# EAGLE design campainha (EAGLE 7.4.0)
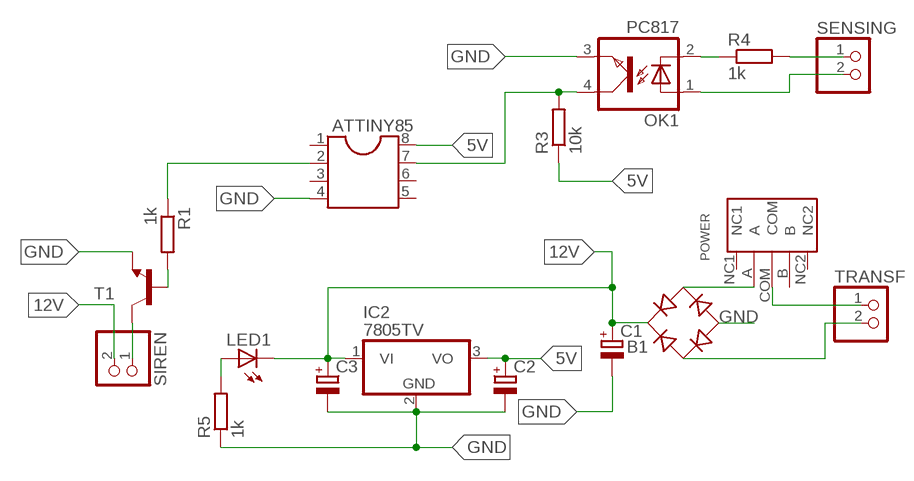
[diagram p0: schematic, sheet 1]

## Parts
ATTINY85  DIL8S  [SOCKET-08]
B1  DBDB104G  [DB]
C1  CPOL-EUE2,5-6E  [E2,5-6E]
C2  CPOL-EUE1.8-4  [E1,8-4]
C3  CPOL-EUE1.8-4  [E1,8-4]
IC2  7805TV  [TO220V]
LED1  LED3MM  [LED3MM]
OK1  PC817  [DIL04]
POWER  SWITCH-2H-3P-REINFORCE  [3P-2CH-2.0-8.8X4.4X4.7H-90D-REINFORCE]
R1  1k  R-EU_0204/7  [0204/7]
R3  10k  R-EU_0204/7  [0204/7]
R4  1k  R-EU_0204/7  [0204/7]
R5  1k  R-EU_0204/7  [0204/7]
SENSING  PINHD-1X2  [1X02]
SIREN  PINHD-1X2  [1X02]
T1  TRANSISTOR_NPNTO92  [TO-92]
TRANSF  PINHD-1X2  [1X02]

## Nets
5V: ATTINY85.8 C2.+ IC2.3(VO) R3.1
12V: B1.+ C1.+ C3.+ IC2.1(VI) LED1.K(C) SIREN.2
GND: ATTINY85.4 B1.- C1.- C2.- C3.- IC2.2(GND) OK1.3(EMIT) R5.1 T1.1(E)
N$1: OK1.2(C) R4.1
N$2: R4.2 SENSING.1
N$3: OK1.1(A) SENSING.2
N$4: ATTINY85.7 OK1.4(COL) R3.2
N$5: B1.AC2 POWER.A
N$6: POWER.COM TRANSF.1
N$7: B1.AC1 TRANSF.2
N$8: ATTINY85.2 R1.1
N$9: R1.2 T1.2(B)
N$11: SIREN.1 T1.3(C)
N$13: LED1.A R5.2
Unconnected: ATTINY85.1 ATTINY85.3 ATTINY85.5 ATTINY85.6 POWER.B POWER.NC1 POWER.NC2

## Library data of the parts
ATTINY85 = pedro:DIL8: Dual In Line / Socket
B1 = rectifier:DB?*G: Single Phase 1.0 AMP Glass Passivated Bridge Rectifier Taiwan Semiconductor Co.,Ltd. - TSC Source: http://www.taiwansemi.com/TSCbig5/ezcatfiles/cust/img/img/db101g.pdf http://www.ts.com.tw/db/pictures/modules/PDT/PDT060207001/DBLS201G.pdf
C1-C3 = rcl:CPOL-EU: POLARIZED CAPACITOR, European symbol
IC2 = linear:78*: Positive VOLTAGE REGULATOR Source: http://cache.national.com/ds/LM/LM78L05.pdf http://www.fairchildsemi.com/ds/LM/LM7805.pdf
LED1 = led:LED: LED OSRAM: - CHIPLED LG R971, LG N971, LY N971, LG Q971, LY Q971, LO R971, LY R971 LH N974, LH R974 LS Q976, LO Q976, LY Q976 LO Q996 - Hyper CHIPLED LW Q18S LB Q993, LB Q99A, LB R99A - SideLED LS A670, LO A670, LY A670, LG A670, LP A670 LB A673, LV A673, LT A673, LW A673 LH A674 LY A675 LS A676, LA A676, LO A676, LY A676, LW A676 LS A679, LY A679, LG A679 - Hyper Micro SIDELED® LS Y876, LA Y876, LO Y876, LY Y876 LT Y87S - SmartLED LW L88C, LW L88S LB L89C, LB L89S, LG L890 LS L89K, LO L89K, LY L89K LS L896, LA L896, LO L896, LY L896 - TOPLED LS T670, LO T670, LY T670, LG T670, LP T670 LSG T670, LSP T670, LSY T670, LOP T670, LYG T670 LG T671, LOG T671, LSG T671 LB T673, LV T673, LT T673, LW T673 LH T674 LS T676, LA T676, LO T676, LY T676, LB T676, LH T676, LSB T676, LW T676 LB T67C, LV T67C, LT T67C, LS T67K, LO T67K, LY T67K, LW E67C LS E67B, LA E67B, LO E67B, LY E67B, LB E67C, LV E67C, LT E67C LW T67C LS T679, LY T679, LG T679 LS T770, LO T770, LY T770, LG T770, LP T770 LB T773, LV T773, LT T773, LW T773 LH T774 LS E675, LA E675, LY E675, LS T675 LS T776, LA T776, LO T776, LY T776, LB T776 LHGB T686 LT T68C, LB T68C - Hyper Mini TOPLED® LB M676 - Mini TOPLED Santana® LG M470 LS M47K, LO M47K, LY M47K Source: http://www.osram.convergy.de LUXEON: - LUMILED® LXK2-PW12-R00, LXK2-PW12-S00, LXK2-PW14-U00, LXK2-PW14-V00 LXK2-PM12-R00, LXK2-PM12-S00, LXK2-PM14-U00 LXK2-PE12-Q00, LXK2-PE12-R00, LXK2-PE12-S00, LXK2-PE14-T00, LXK2-PE14-U00 LXK2-PB12-K00, LXK2-PB12-L00, LXK2-PB12-M00, LXK2-PB14-N00, LXK2-PB14-P00, LXK2-PB14-Q00 LXK2-PR12-L00, LXK2-PR12-M00, LXK2-PR14-Q00, LXK2-PR14-R00 LXK2-PD12-Q00, LXK2-PD12-R00, LXK2-PD12-S00 LXK2-PH12-R00, LXK2-PH12-S00 LXK2-PL12-P00, LXK2-PL12-Q00, LXK2-PL12-R00 Source: www.luxeon.com KINGBRIGHT: KA-3528ASYC Source: www.kingbright.com
OK1 = optocoupler:PC817: SHARP OPTO COUPLER; MPN: PC817X4J000F; OC_FARNELL: 9707727; OC_NEWARK: 97K7059
POWER = pedro:SWITCH-2H-3P-REINFORCE
R1 R3-R5 = resistor:R-EU_: RESISTOR, European symbol
SENSING SIREN TRANSF = pinhead:PINHD-1X2: PIN HEADER
T1 = SparkFun-DiscreteSemi:TRANSISTOR_NPN: Generic NPN BJT MMBT2222A - TRANS-08049 (SOT-23, 1A 40V) MPSA42 - TRANS-09116 (SOT-23, 500mA 300V) MMBT5088LT1G - TRANS-11160 (SOT-23, 50 mA 30V)

## Board
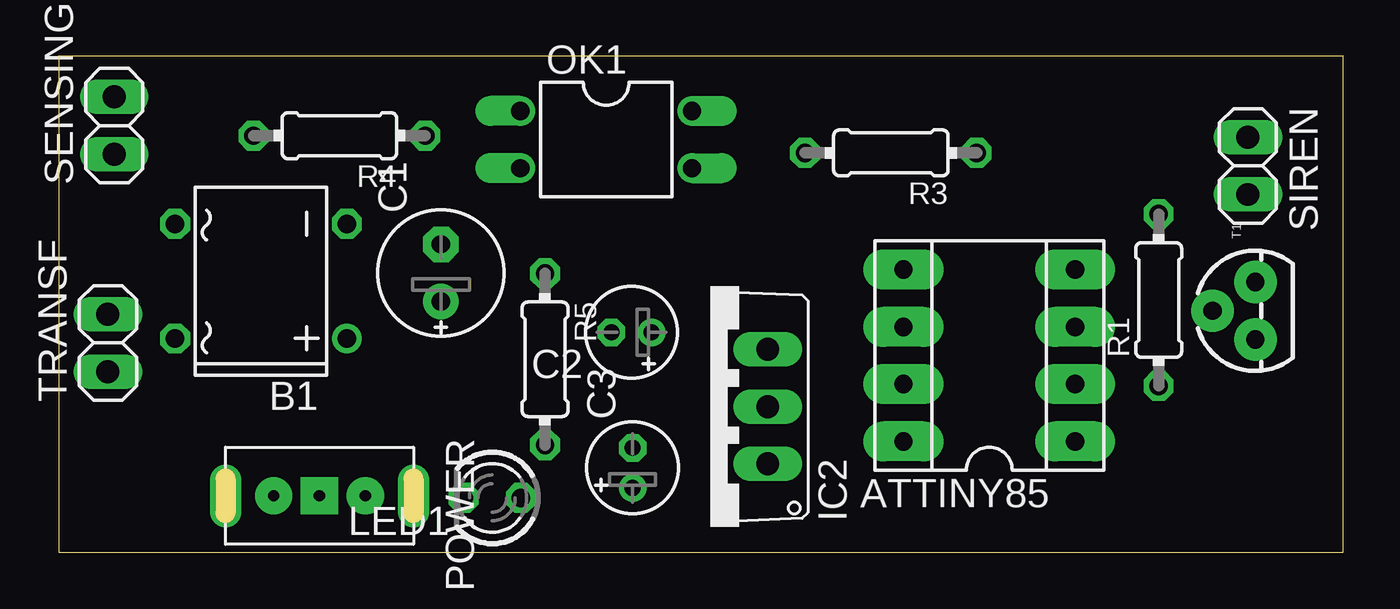
[diagram p1: board, top side]
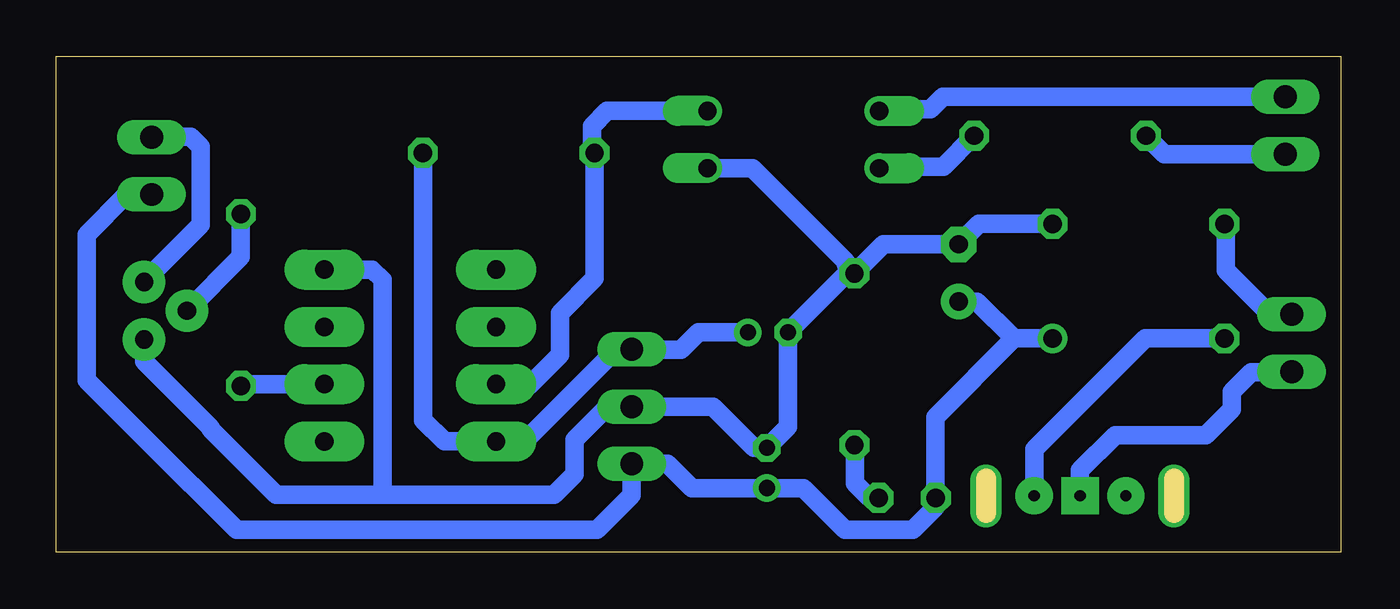
[diagram p2: board, bottom side, seen from below]

Size 57 x 22 mm. Coordinates in mm from the lower left corner, seen from the top.
Outline: 0,0 57,0 57,22 0,22 0,0
Copper layers (1*16): Top 0.035mm / dielectric 1.5mm / Bottom 0.035mm
Design rules "default": minimum track width 10mil, minimum drill 24mil, track to track 8mil, track to pad 8mil, pad to pad 8mil, via to via 8mil, smd to smd 8mil, copper to edge 40mil, drill to drill 8mil, minimum pad ring 10mil, minimum via ring 8mil, stop-mask expansion 4mil, vias tented up to drill 0mil, thermal gap 10mil

### Footprints (pad centres in the part's own frame; a part is rotated, then mirrored left to right if it is on the bottom)
SOCKET-08 = drill 0.813 pad 1.778 long: 1 -3.81,-3.81; 2 -1.27,-3.81; 3 1.27,-3.81; 4 3.81,-3.81; 5 3.81,3.81; 6 1.27,3.81; 7 -1.27,3.81; 8 -3.81,3.81
DB = drill 0.813: + -2.54,-3.81 | drill 0.813 octagon: - 2.54,-3.81; AC1 2.54,3.81; AC2 -2.54,3.81
E2,5-6E = drill 0.813 pad 1.575: + -1.27,0 | drill 0.813 pad 1.575 octagon: - 1.27,0
E1,8-4 = drill 0.711 pad 1.168: + -0.889,0 | drill 0.711 pad 1.168 octagon: - 0.889,0
TO220V = drill 1.016 long: 1 -2.54,-2.54; 2 0,-2.54; 3 2.54,-2.54
LED3MM = drill 0.813 octagon: A -1.27,0; K 1.27,0
DIL04 = drill 0.813 offset: 1 -1.27,-3.81; 2 1.27,-3.81; 3 1.27,3.81; 4 -1.27,3.81
3P-2CH-2.0-8.8X4.4X4.7H-90D-REINFORCE = drill 0.5 pad 1.651: A 0,2.032; B 0,-2.032 | drill 0.5 pad 1.651 square: COM 0,0 | drill 0.5 pad 1.397 long: NC1 0,4.166; NC2 0,-4.166
0204/7 = drill 0.813 octagon: 1 -3.81,0; 2 3.81,0
1X02 = drill 1.016 long: 1 -1.27,0; 2 1.27,0
TO-92 = drill 0.813 pad 1.88: 1 -1.27,0; 2 0,1.905; 3 1.27,0

### Placement (x,y rotation side)
ATTINY85  41.3,8.73 90 top
B1  8.98,12.03 90 top
C1  16.97,12.39 90 top
C2  25.42,9.76 180 top
C3  25.47,3.74 90 top
IC2  28.93,6.46 90 top
LED1  19.25,2.42 180 top
OK1  24.3,18.31 270 top
POWER  11.58,2.51 270 top
R1  48.81,11.2 90 top
R3  36.93,17.72 180 top
R4  12.46,18.48 180 top
R5  21.59,8.57 270 top
SENSING  2.47,18.93 90 top
SIREN  52.77,17.14 270 top
T1  53.1,10.72 90 top
TRANSF  2.19,9.29 90 top

### Tracks (layer width: path | path; a pad name or v marks a point on that pad's centre or on a via)
5V
  Bottom 0.813: C2.+ 28.5,9.76 29.28,8.98 31.45,8.98 IC2.3 32.15,9 36.08,5.07 37.34,5.07 ATTINY85.8 39.78,4.92 40.72,5.86 40.72,17.7 R3.1
12V
  Bottom 0.813: B1.+ 14.51,9.49 | 14.51,9.49 18,6 18,2.44 LED1.K 18,2.4 18,2 19,1 22,1 23.86,2.85 C3.+ 28.8,2.85 29.88,3.94 31.46,3.94 IC2.1 31.47,2.53 33,1 49,1 51,3 51.02,3 55.65,7.63 55.65,14.1 53.87,15.88 SIREN.2 | C1.+ 16.14,11.12 14.51,9.49
GND
  Bottom 0.813: B1.- 16.07,14.57 C1.- 20.3,13.66 R5.1 | R5.1 21.92,12.38 C2.- 24.54,5.57 C3.- 26.04,4.63 27.87,6.46 IC2.2 32.54,6.46 34,5 34,3.48 34.91,2.56 42.75,2.56 | OK1.3 26.12,17.04 21.97,12.89 21.97,12.76 R5.1 | 42.75,2.56 47.25,2.56 50.15,5.46 50.15,5.52 53.09,8.47 53.09,9.43 T1.1 | ATTINY85.4 42.98,12.54 42.53,12.09 42.53,2.79 42.75,2.56
N$1
  Bottom 0.813: OK1.2 20.41,17.11 17.65,17.11 R4.1
N$2
  Bottom 0.813: SENSING.1 7.83,17.66 R4.2
N$3
  Bottom 0.813: SENSING.2 17.67,20.2 18.23,19.65 20.42,19.65 OK1.1
N$4
  Bottom 0.813: OK1.4 32.57,19.58 33.24,18.91 33.24,17.84 R3.2 33.12,12.15 34.66,10.62 34.66,8.76 36.03,7.39 37.42,7.39 ATTINY85.7
N$5
  Bottom 0.813: B1.AC2 8.69,9.49 13.6,4.58 13.6,2.52 POWER.A
N$6
  Bottom 0.813: POWER.COM 11.58,3.64 10.02,5.21 6,5.21 4.85,6.35 4.85,7.13 3.99,7.99 2.22,7.99 TRANSF.1
N$7
  Bottom 0.813: TRANSF.2 3.15,10.56 5.12,12.52 5.12,14.52 B1.AC1
N$8
  Bottom 0.813: ATTINY85.2 48.74,7.46 R1.1
N$9
  Bottom 0.813: R1.2 48.81,13.1 T1.2
N$11
  Bottom 0.813: T1.3 53.1,12.03 50.59,14.54 50.59,18 51.03,18.44 52.75,18.44 SIREN.1
N$13
  Bottom 0.813: LED1.A 20.93,2.42 21.57,3.06 21.57,4.74 R5.2

### Text on the board
TEXTO: + | + | POWER